# EAGLE design gps_tracker_mark2 (EAGLE 7.4.0)

## Sheet 1 of 3: Flight
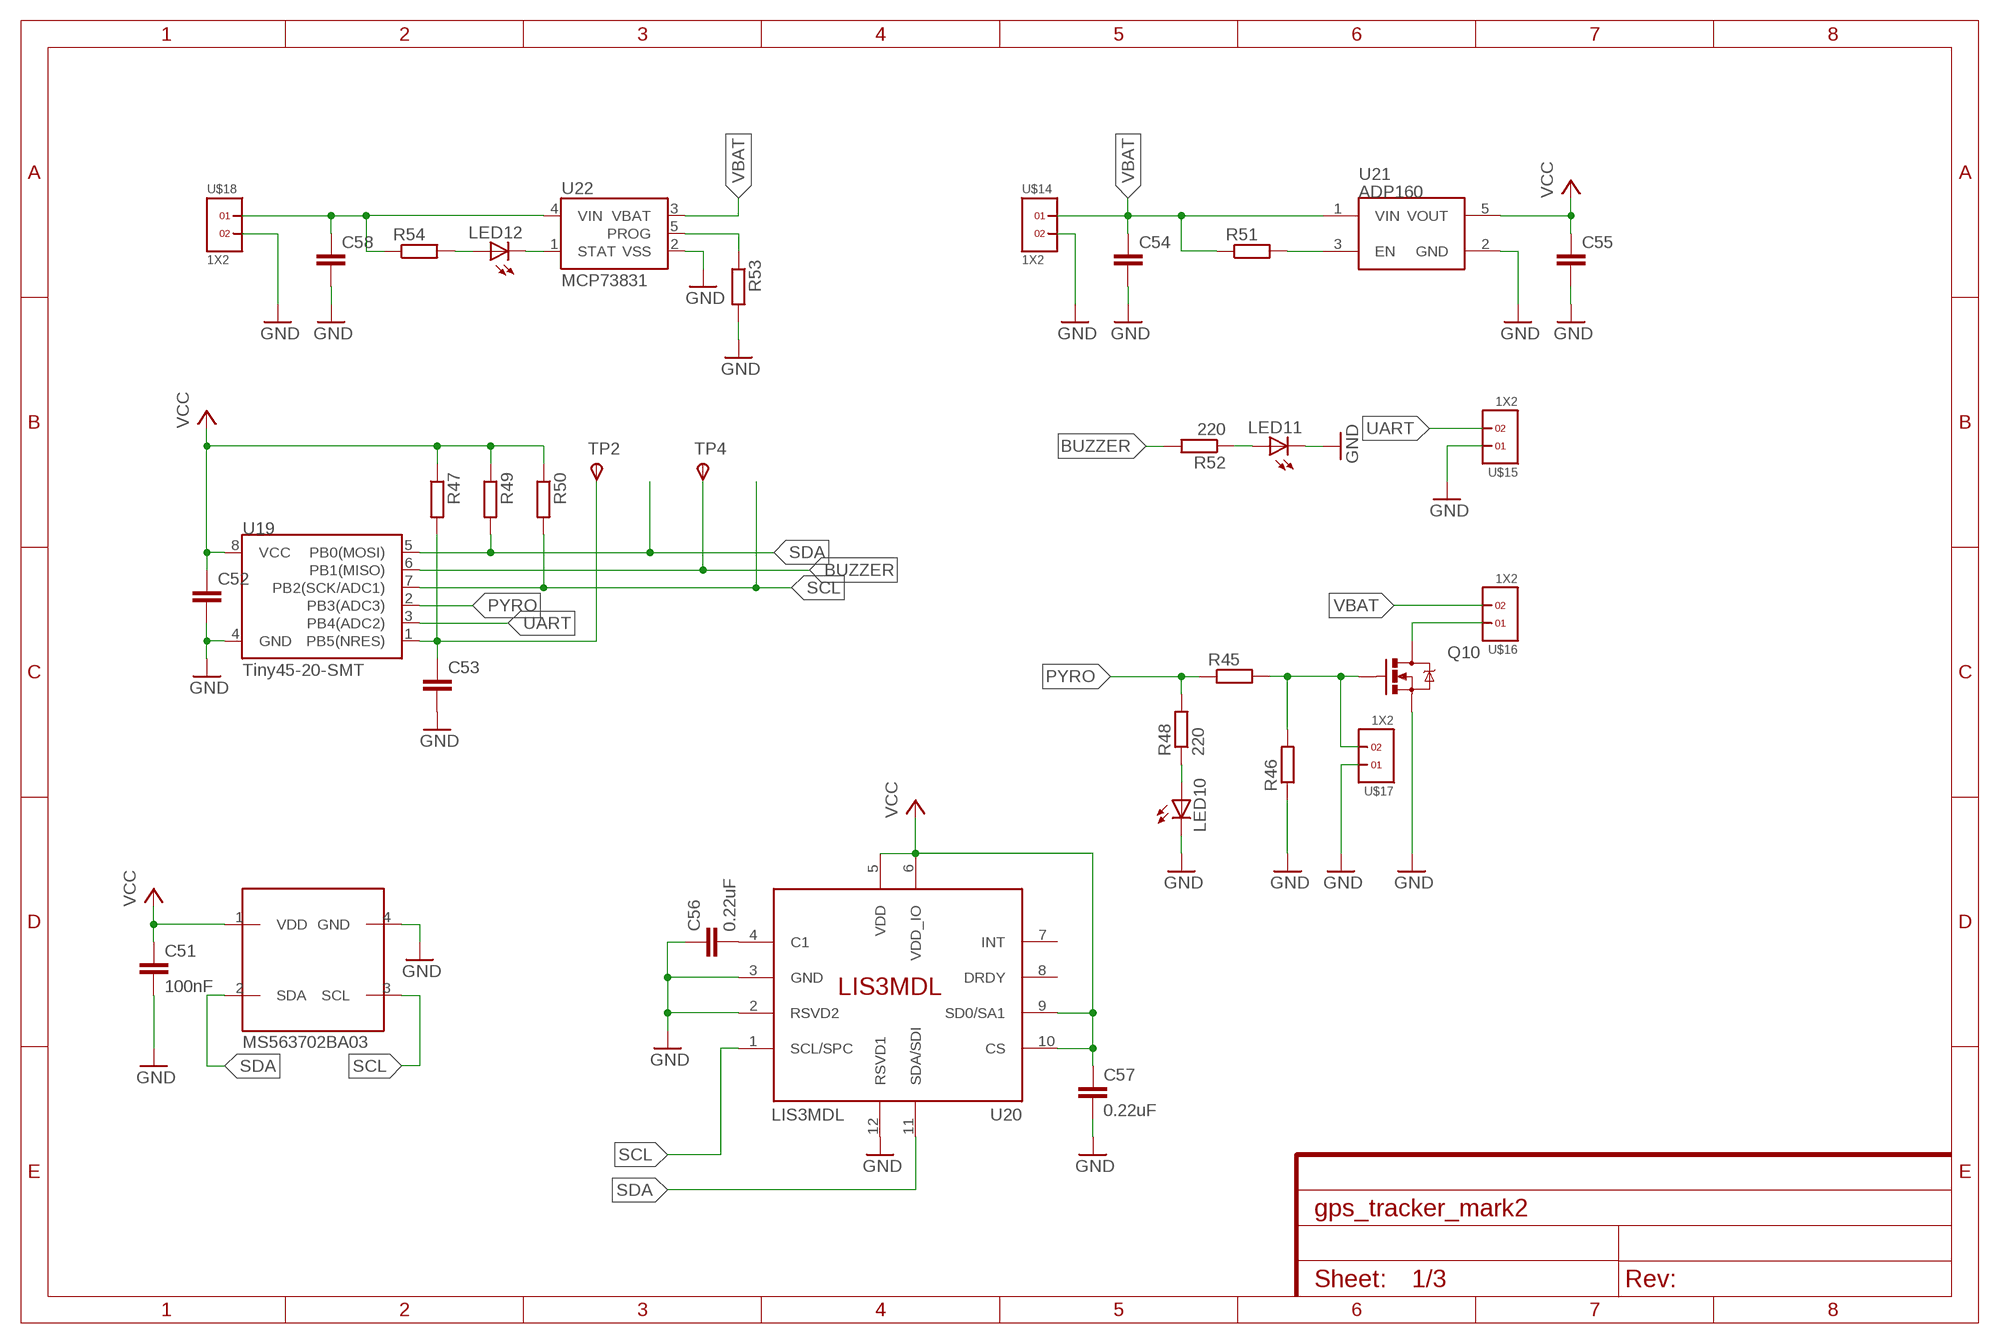
[diagram p0: schematic, sheet 1]

### Parts
C51  100nF  C-EUC0603  [C0603]
C52  C-EUC1206  [C1206]
C53  C-EUC0603  [C0603]
C54  C-EUC0603  [C0603]
C55  C-EUC0603  [C0603]
C56  0.22uF  C-EUC0603K  [C0603K]
C57  0.22uF  C-EUC0603  [C0603]
C58  C-EUC0603  [C0603]
IC2  MS563702BA03  [MS5637]
LED10  LEDCHIPLED_0805  [CHIPLED_0805]
LED11  LEDCHIPLED_0805  [CHIPLED_0805]
LED12  LEDCHIPLED_0603  [CHIPLED_0603]
Q10  MOSFET-NCHANNELBSS123LT1G  [SOT23-3]
R45  R-EU_R0603  [R0603]
R46  R-EU_R0603  [R0603]
R47  R-EU_R0603  [R0603]
R48  220  R-EU_R0603  [R0603]
R49  R-EU_R0603  [R0603]
R50  R-EU_R0603  [R0603]
R51  R-EU_R0603  [R0603]
R52  220  R-EU_R0603  [R0603]
R53  R-EU_R0603  [R0603]
R54  R-EU_R0603  [R0603]
TP2  TPSB1,27  [B1,27]
TP4  TPSB1,27  [B1,27]
U19  Tiny45-20-SMT  ATTINY45TINY45-20-SMT  [SO08-EIAJ]
U20  LIS3MDL  [VFLGA-12]
U21  ADP160  [SOT23-5]
U22  MCP73831  [SOT23-5]
U$14  1X2  [1X2]
U$15  1X2  [1X2]
U$16  1X2  [1X2]
U$17  1X2  [1X2]
U$18  1X2  [1X2]

### Nets
BUZZER: R52.2 TP4.TP(PP) U19.6(PB1(MISO))
GND: C51.2 C52.2 C53.2 C54.2 C55.2 C56.1 C57.2 C58.2 IC2.4(GND) LED10.C LED11.C Q10.2(S) R46.1 R53.2 U19.4(GND) U20.2(RSVD2) U20.3(GND) U20.12(RSVD1) U21.2(GND) U22.2(VSS) U$14.2 U$15.1 U$17.1 U$18.2
N$132: C53.1 R47.2 TP2.TP(PP) U19.1(PB5(NRES))
N$133: Q10.1(G) R45.2 R46.2 U$17.2
N$134: LED10.A R48.1
N$135: C56.2 U20.4(C1)
N$136: R51.2 U21.3(EN)
N$137: LED11.A R52.1
N$138: Q10.3(D) U$16.1
N$139: R53.1 U22.5(PROG)
N$140: LED12.C U22.1(STAT)
N$141: LED12.A R54.2
N$142: C58.1 R54.1 U22.4(VIN) U$18.1
PYRO: R45.1 R48.2 U19.2(PB3(ADC3))
SCL: IC2.3(SCL) R50.2 U19.7(PB2(SCK/ADC1)) U20.1(SCL/SPC)
SDA: IC2.2(SDA) R49.2 U19.5(PB0(MOSI)) U20.11(SDA/SDI)
UART: U19.3(PB4(ADC2)) U$15.2
VBAT: C54.1 R51.1 U21.1(VIN) U22.3(VBAT) U$14.1 U$16.2
VCC: C51.1 C52.1 C55.1 C57.1 IC2.1(VDD) R47.1 R49.1 R50.1 U19.8(VCC) U20.5(VDD) U20.6(VDD_IO) U20.9(SD0/SA1) U20.10(CS) U21.5(VOUT)
Unconnected: U20.7(INT) U20.8(DRDY)

## Sheet 2 of 3: A2235-H
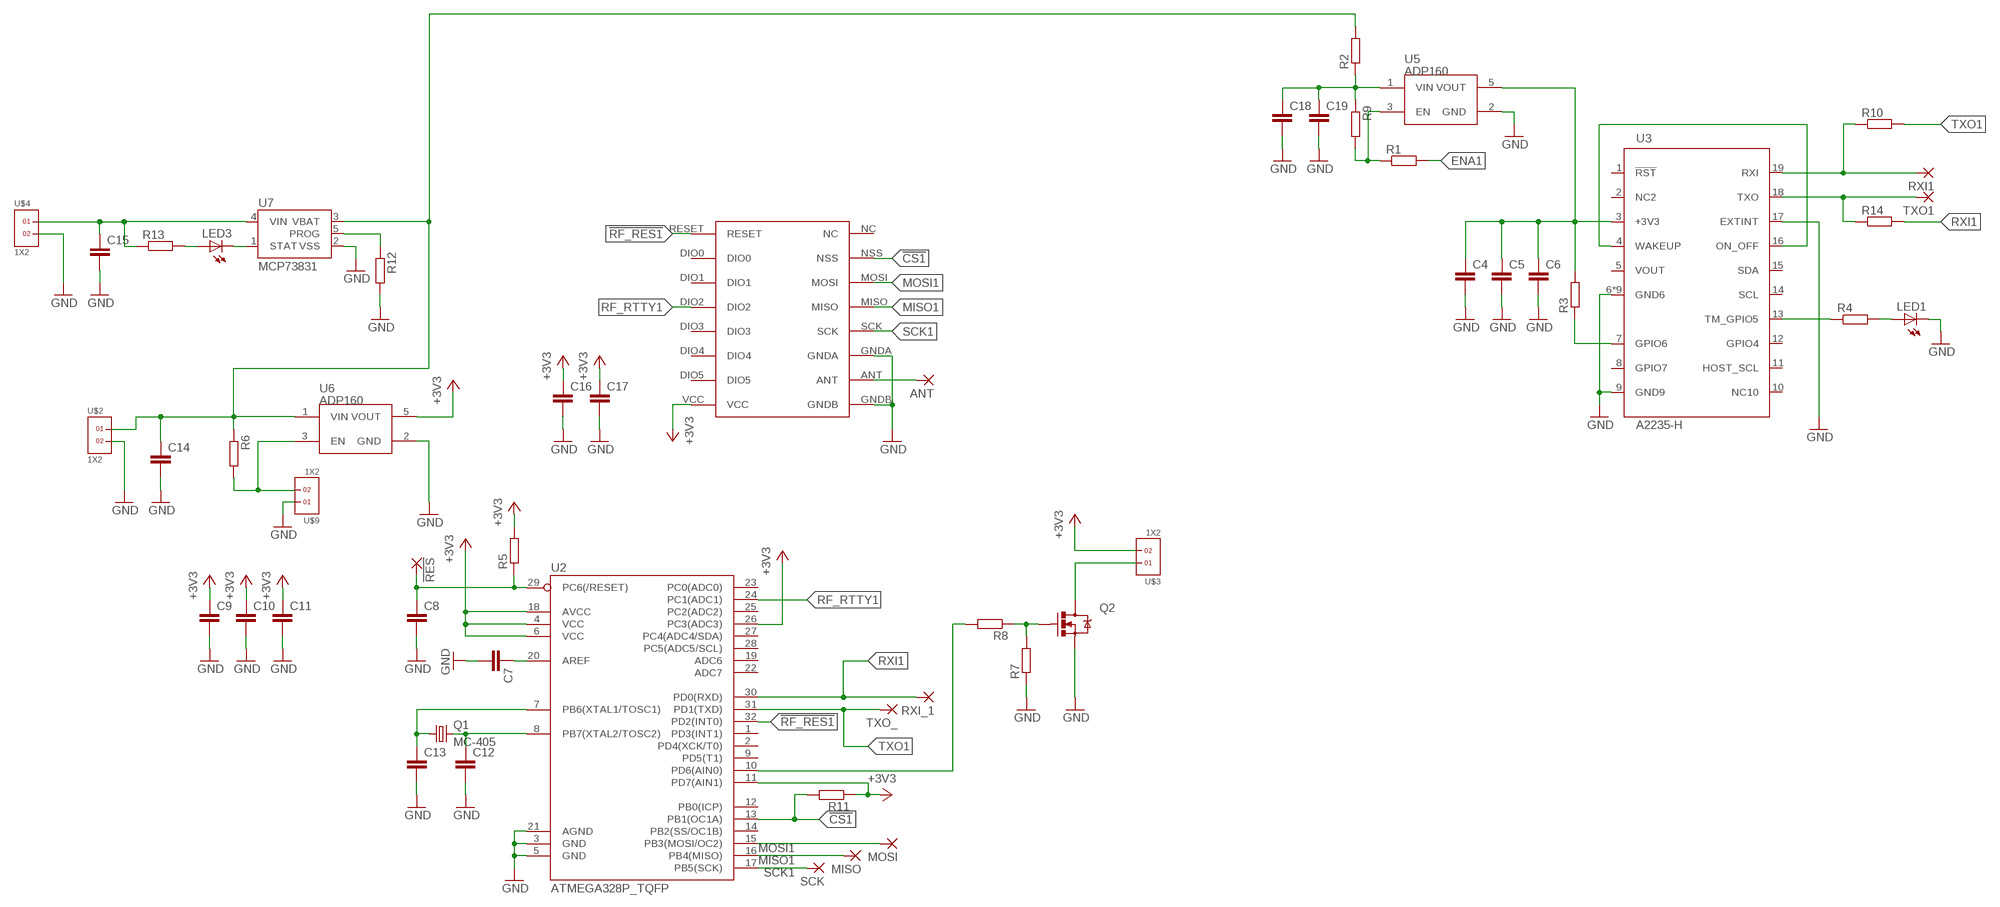
[diagram p1: schematic, sheet 2]

### Parts
!RES  SMD2  [SMD1,27-2,54]
ANT  SMD2  [SMD1,27-2,54]
C4  C-EUC0603  [C0603]
C5  C-EUC0603  [C0603]
C6  C-EUC0603  [C0603]
C7  C-EUC0603  [C0603]
C8  C-EUC0603  [C0603]
C9  C-EUC0603  [C0603]
C10  C-EUC0603  [C0603]
C11  C-EUC0603  [C0603]
C12  C-EUC0603  [C0603]
C13  C-EUC0603  [C0603]
C14  C-EUC0603  [C0603]
C15  C-EUC0603  [C0603]
C16  C-EUC0603  [C0603]
C17  C-EUC0603  [C0603]
C18  C-EUC0603  [C0603]
C19  C-EUC0603  [C0603]
LED1  LEDCHIPLED_0603  [CHIPLED_0603]
LED3  LEDCHIPLED_0603  [CHIPLED_0603]
MISO  SMD2  [SMD1,27-2,54]
MOSI  SMD2  [SMD1,27-2,54]
Q1  MC-405  [MC-405]
Q2  MOSFET-NCHANNELAO3404A  [SOT23-3]
R1  R-EU_R0603  [R0603]
R2  R-EU_R0603  [R0603]
R3  R-EU_R0603  [R0603]
R4  R-EU_R0603  [R0603]
R5  R-EU_R0603  [R0603]
R6  R-EU_R0603  [R0603]
R7  R-EU_R0603  [R0603]
R8  R-EU_R0603  [R0603]
R9  R-EU_R0603  [R0603]
R10  R-EU_R0603  [R0603]
R11  R-EU_R0603  [R0603]
R12  R-EU_R0603  [R0603]
R13  R-EU_R0603  [R0603]
R14  R-EU_R0603  [R0603]
RXI1  SMD2  [SMD1,27-2,54]
RXI_1  SMD2  [SMD1,27-2,54]
SCK  SMD2  [SMD1,27-2,54]
TXO1  SMD2  [SMD1,27-2,54]
TXO_  SMD2  [SMD1,27-2,54]
U2  ATMEGA328P_TQFP  [TQFP32-08]
U3  A2235-H  [A2235-H]
U5  ADP160  [SOT23-5]
U6  ADP160  [SOT23-5]
U7  MCP73831  [SOT23-5]
U$1  RFM69HW  [RFM]
U$2  1X2  [1X2]
U$3  1X2  [1X2]
U$4  1X2  [1X2]
U$9  1X2  [1X2]

### Nets
!CS1: R11.2 U2.13(PB1(OC1A)) U$1.NSS
!RF_RES1: U2.32(PD2(INT0)) U$1.RESET
+3V3_1: C9.1 C10.1 C11.1 C16.1 C17.1 R5.2 R11.1 U2.4(VCC) U2.6(VCC) U2.11(PD7(AIN1)) U2.18(AVCC) U2.26(PC3(ADC3)) U6.5(VOUT) U$1.VCC U$3.2 ; supply symbol labelled +3V3
+BAT1: C14.1 R2.2 R6.1 U6.1(VIN) U7.3(VBAT) U$2.1
ENA1: R1.2 R6.2 U6.3(EN) U$9.2
GND1: C4.2 C5.2 C6.2 C7.2 C8.2 C9.2 C10.2 C11.2 C12.2 C13.2 C14.2 C15.2 C16.2 C17.2 C18.2 C19.2 LED1.C Q2.2(S) R7.1 R12.2 U2.3(GND) U2.5(GND) U2.21(AGND) U3.6(GND6) U3.9(GND9) U3.17(EXTINT) U3.101(GND6) U3.102(GND6) U3.103(GND6) U3.104(GND6) U3.105(GND6) U3.106(GND6) U3.107(GND6) U3.108(GND6) U5.2(GND) U6.2(GND) U7.2(VSS) U$1.GNDA U$1.GNDB U$2.2 U$4.2 U$9.1 ; supply symbol labelled GND
MISO1: MISO.1(P) U2.16(PB4(MISO)) U$1.MISO
MOSI1: MOSI.1(P) U2.15(PB3(MOSI/OC2)) U$1.MOSI
N$2: R1.1 R9.2 U5.3(EN)
N$3: C18.1 C19.1 R2.1 R9.1 U5.1(VIN)
N$6: R3.1 U3.7(GPIO6)
N$7: LED1.A R4.2
N$8: R4.1 U3.13(TM_GPIO5)
N$9: U3.4(WAKEUP) U3.16(ON_OFF)
N$11: R12.1 U7.5(PROG)
N$12: C7.1 U2.20(AREF)
N$13: !RES.1(P) C8.1 R5.1 U2.29(PC6(/RESET))
N$14: ANT.1(P) U$1.ANT
N$15: C12.1 Q1.2 U2.8(PB7(XTAL2/TOSC2))
N$16: C13.1 Q1.1 U2.7(PB6(XTAL1/TOSC1))
N$18: LED3.C U7.1(STAT)
N$19: Q2.1(G) R7.2 R8.1
N$20: R8.2 U2.10(PD6(AIN0))
N$21: Q2.3(D) U$3.1
N$22: LED3.A R13.2
N$24: C15.1 R13.1 U7.4(VIN) U$4.1
N$27: C4.1 C5.1 C6.1 R3.2 U3.3(+3V3) U5.5(VOUT)
RF_RTTY1: U2.24(PC1(ADC1)) U$1.DIO2
RXI1: R14.2 RXI_1.1(P) U2.30(PD0(RXD))
RXI_G1: R10.1 RXI1.1(P) U3.19(RXI)
SCK1: SCK.1(P) U2.17(PB5(SCK)) U$1.SCK
TXO1: R10.2 TXO_.1(P) U2.31(PD1(TXD))
TXO_G1: R14.1 TXO1.1(P) U3.18(TXO)
Unconnected: U2.1(PD3(INT1)) U2.2(PD4(XCK/T0)) U2.9(PD5(T1)) U2.12(PB0(ICP)) U2.14(PB2(SS/OC1B)) U2.19(ADC6) U2.22(ADC7) U2.23(PC0(ADC0)) U2.25(PC2(ADC2)) U2.27(PC4(ADC4/SDA)) U2.28(PC5(ADC5/SCL)) U3.1(!RST) U3.2(NC2) U3.8(GPIO7) U3.10(NC10) U3.11(HOST_SCL) U3.12(GPIO4) U3.14(SCL) U3.15(SDA) U$1.DIO0 U$1.DIO1 U$1.DIO3 U$1.DIO4 U$1.DIO5 U$1.NC

## Sheet 3 of 3: ORG1411
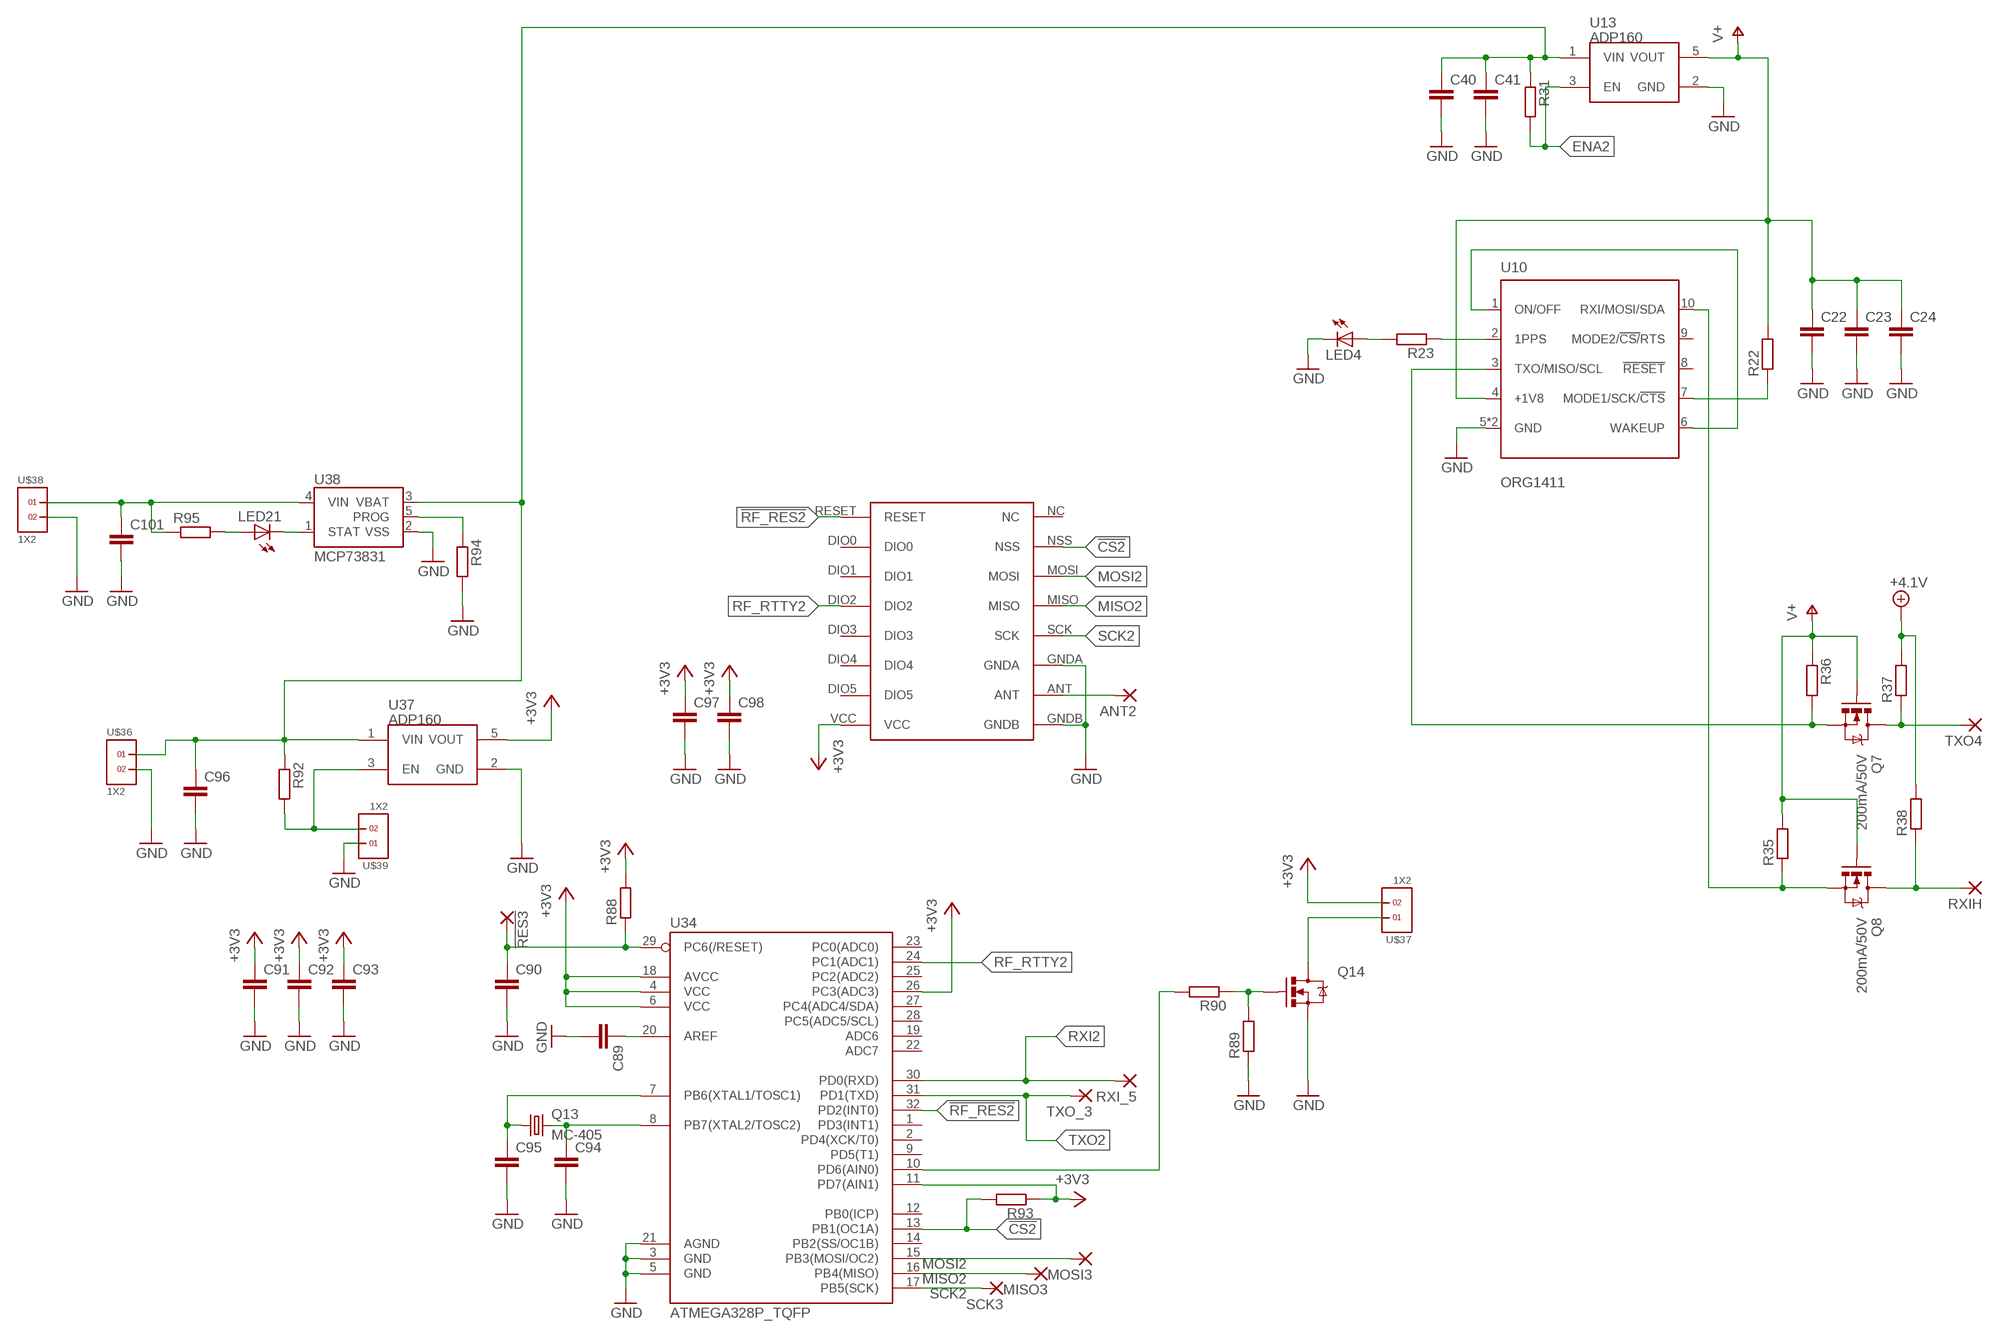
[diagram p2: schematic, sheet 3]

### Parts
!RES3  SMD2  [SMD1,27-2,54]
ANT2  SMD2  [SMD1,27-2,54]
C22  C-EUC0603  [C0603]
C23  C-EUC0603  [C0603]
C24  C-EUC0603  [C0603]
C40  C-EUC0603  [C0603]
C41  C-EUC0603  [C0603]
C89  C-EUC0603  [C0603]
C90  C-EUC0603  [C0603]
C91  C-EUC0603  [C0603]
C92  C-EUC0603  [C0603]
C93  C-EUC0603  [C0603]
C94  C-EUC0603  [C0603]
C95  C-EUC0603  [C0603]
C96  C-EUC0603  [C0603]
C97  C-EUC0603  [C0603]
C98  C-EUC0603  [C0603]
C101  C-EUC0603  [C0603]
LED4  LEDCHIPLED_0603  [CHIPLED_0603]
LED21  LEDCHIPLED_0603  [CHIPLED_0603]
MISO3  SMD2  [SMD1,27-2,54]
MOSI3  SMD2  [SMD1,27-2,54]
Q7  200mA/50V  MOSFET-NCHANNELBSS138  [SOT23-3]
Q8  200mA/50V  MOSFET-NCHANNELBSS138  [SOT23-3]
Q13  MC-405  [MC-405]
Q14  MOSFET-NCHANNELAO3404A  [SOT23-3]
R22  R-EU_R0603  [R0603]
R23  R-EU_R0603  [R0603]
R31  R-EU_R0603  [R0603]
R35  R-EU_R0603  [R0603]
R36  R-EU_R0603  [R0603]
R37  R-EU_R1206  [R1206]
R38  R-EU_R1206  [R1206]
R88  R-EU_R0603  [R0603]
R89  R-EU_R0603  [R0603]
R90  R-EU_R0603  [R0603]
R92  R-EU_R0603  [R0603]
R93  R-EU_R0603  [R0603]
R94  R-EU_R0603  [R0603]
R95  R-EU_R0603  [R0603]
RXI_5  SMD2  [SMD1,27-2,54]
RXIH  SMD2  [SMD1,27-2,54]
SCK3  SMD2  [SMD1,27-2,54]
TXO4  SMD2  [SMD1,27-2,54]
TXO_3  SMD2  [SMD1,27-2,54]
U10  ORG1411  [ORG1411]
U13  ADP160  [SOT23-5]
U34  ATMEGA328P_TQFP  [TQFP32-08]
U37  ADP160  [SOT23-5]
U38  MCP73831  [SOT23-5]
U$35  RFM69HW  [RFM]
U$36  1X2  [1X2]
U$37  1X2  [1X2]
U$38  1X2  [1X2]
U$39  1X2  [1X2]

### Nets
!CS2: R93.2 U34.13(PB1(OC1A)) U$35.NSS
!RF_RES2: U34.32(PD2(INT0)) U$35.RESET
+3V3_2: C91.1 C92.1 C93.1 C97.1 C98.1 R88.2 R93.1 U34.4(VCC) U34.6(VCC) U34.11(PD7(AIN1)) U34.18(AVCC) U34.26(PC3(ADC3)) U37.5(VOUT) U$35.VCC U$37.2 ; supply symbol labelled +3V3
+4.1V: R37.2 R38.2
+BAT2: C40.1 C41.1 C96.1 R31.1 R92.1 U13.1(VIN) U37.1(VIN) U38.3(VBAT) U$36.1
ANT2: ANT2.1(P) U$35.ANT
ENA2: R31.2 R92.2 U13.3(EN) U37.3(EN) U$39.2
GND2: C22.2 C23.2 C24.2 C40.2 C41.2 C89.2 C90.2 C91.2 C92.2 C93.2 C94.2 C95.2 C96.2 C97.2 C98.2 C101.2 LED4.C Q14.2(S) R89.1 R94.2 U10.5(GND) U10.11(GND) U13.2(GND) U34.3(GND) U34.5(GND) U34.21(AGND) U37.2(GND) U38.2(VSS) U$35.GNDA U$35.GNDB U$36.2 U$38.2 U$39.1 ; supply symbol labelled GND
MISO2: MISO3.1(P) U34.16(PB4(MISO)) U$35.MISO
MOSI2: MOSI3.1(P) U34.15(PB3(MOSI/OC2)) U$35.MOSI
N$29: U10.1(ON/OFF) U10.6(WAKEUP)
N$30: R22.1 U10.7(MODE1/SCK/!CTS)
N$31: R23.1 U10.2(1PPS)
N$32: LED4.A R23.2
N$54: Q7.2(S) R36.2 U10.3(TXO/MISO/SCL)
N$55: Q7.3(D) R37.1 TXO4.1(P)
N$56: Q8.3(D) R38.1 RXIH.1(P)
N$57: Q8.2(S) R35.1 U10.10(RXI/MOSI/SDA)
N$162: C89.1 U34.20(AREF)
N$163: !RES3.1(P) C90.1 R88.1 U34.29(PC6(/RESET))
N$165: C94.1 Q13.2 U34.8(PB7(XTAL2/TOSC2))
N$166: C95.1 Q13.1 U34.7(PB6(XTAL1/TOSC1))
N$167: Q14.1(G) R89.2 R90.1
N$168: R90.2 U34.10(PD6(AIN0))
N$169: Q14.3(D) U$37.1
N$171: R94.1 U38.5(PROG)
N$172: LED21.C U38.1(STAT)
N$173: LED21.A R95.2
N$174: C101.1 R95.1 U38.4(VIN) U$38.1
RF_RTTY2: U34.24(PC1(ADC1)) U$35.DIO2
RXI2: RXI_5.1(P) U34.30(PD0(RXD))
SCK2: SCK3.1(P) U34.17(PB5(SCK)) U$35.SCK
TXO2: TXO_3.1(P) U34.31(PD1(TXD))
V+: C22.1 C23.1 C24.1 Q7.1(G) Q8.1(G) R22.2 R35.2 R36.1 U10.4(+1V8) U13.5(VOUT)
Unconnected: U10.8(!RESET) U10.9(MODE2/!CS/!RTS) U34.1(PD3(INT1)) U34.2(PD4(XCK/T0)) U34.9(PD5(T1)) U34.12(PB0(ICP)) U34.14(PB2(SS/OC1B)) U34.19(ADC6) U34.22(ADC7) U34.23(PC0(ADC0)) U34.25(PC2(ADC2)) U34.27(PC4(ADC4/SDA)) U34.28(PC5(ADC5/SCL)) U$35.DIO0 U$35.DIO1 U$35.DIO3 U$35.DIO4 U$35.DIO5 U$35.NC

## Power pins joined to a net without a drawn wire
VOUT: U3.5(VOUT)

## Library data of the parts
!RES !RES3 ANT ANT2 MISO MISO3 MOSI MOSI3 RXI1 RXI_1 RXI_5 RXIH SCK SCK3 TXO1 TXO4 TXO_ TXO_3 = wirepad:SMD2: SMD PAD
C4-C19 C22-C24 C40 C41 C51-C58 C89-C98 C101 = rcl:C-EU: CAPACITOR, European symbol
IC2 = freetronics-original:MS5637
LED1 LED3 LED4 LED10-LED12 LED21 = led:LED: LED OSRAM: - CHIPLED LG R971, LG N971, LY N971, LG Q971, LY Q971, LO R971, LY R971 LH N974, LH R974 LS Q976, LO Q976, LY Q976 LO Q996 - Hyper CHIPLED LW Q18S LB Q993, LB Q99A, LB R99A - SideLED LS A670, LO A670, LY A670, LG A670, LP A670 LB A673, LV A673, LT A673, LW A673 LH A674 LY A675 LS A676, LA A676, LO A676, LY A676, LW A676 LS A679, LY A679, LG A679 - Hyper Micro SIDELED® LS Y876, LA Y876, LO Y876, LY Y876 LT Y87S - SmartLED LW L88C, LW L88S LB L89C, LB L89S, LG L890 LS L89K, LO L89K, LY L89K LS L896, LA L896, LO L896, LY L896 - TOPLED LS T670, LO T670, LY T670, LG T670, LP T670 LSG T670, LSP T670, LSY T670, LOP T670, LYG T670 LG T671, LOG T671, LSG T671 LB T673, LV T673, LT T673, LW T673 LH T674 LS T676, LA T676, LO T676, LY T676, LB T676, LH T676, LSB T676, LW T676 LB T67C, LV T67C, LT T67C, LS T67K, LO T67K, LY T67K, LW E67C LS E67B, LA E67B, LO E67B, LY E67B, LB E67C, LV E67C, LT E67C LW T67C LS T679, LY T679, LG T679 LS T770, LO T770, LY T770, LG T770, LP T770 LB T773, LV T773, LT T773, LW T773 LH T774 LS E675, LA E675, LY E675, LS T675 LS T776, LA T776, LO T776, LY T776, LB T776 LHGB T686 LT T68C, LB T68C - Hyper Mini TOPLED® LB M676 - Mini TOPLED Santana® LG M470 LS M47K, LO M47K, LY M47K Source: http://www.osram.convergy.de LUXEON: - LUMILED® LXK2-PW12-R00, LXK2-PW12-S00, LXK2-PW14-U00, LXK2-PW14-V00 LXK2-PM12-R00, LXK2-PM12-S00, LXK2-PM14-U00 LXK2-PE12-Q00, LXK2-PE12-R00, LXK2-PE12-S00, LXK2-PE14-T00, LXK2-PE14-U00 LXK2-PB12-K00, LXK2-PB12-L00, LXK2-PB12-M00, LXK2-PB14-N00, LXK2-PB14-P00, LXK2-PB14-Q00 LXK2-PR12-L00, LXK2-PR12-M00, LXK2-PR14-Q00, LXK2-PR14-R00 LXK2-PD12-Q00, LXK2-PD12-R00, LXK2-PD12-S00 LXK2-PH12-R00, LXK2-PH12-S00 LXK2-PL12-P00, LXK2-PL12-Q00, LXK2-PL12-R00 Source: www.luxeon.com KINGBRIGHT: KA-3528ASYC Source: www.kingbright.com
Q1 Q13 = gps_tracker:MC-405: kHz RANGE CRYSTAL UNIT SMD Source: MC-306_405_406_E07X.PDF Homepage <http://www.epsontoyocom.co.jp>; FARNELL: 2508596; OC_FARNELL: unknown; OC_NEWARK: unknown
Q2 Q14 = SparkFun-DiscreteSemi:MOSFET-NCHANNEL: Common NMOSFET Parts MFG P/N Store ID Prod ID FDD8780 TRANS-09984 SI7820DN TRANS-11055 FDS6630A IC-08089 2N7002PW TRANS-11151 FQP30N06L COM-10213 TRANS-10060 BSS123LT1G TRANS-08345 BSS138 TRANS-00830 BS170 2N7000; PROD_ID: TRAN-12988
Q7 Q8 = SparkFun-DiscreteSemi:MOSFET-NCHANNEL: Common NMOSFET Parts MFG P/N Store ID Prod ID FDD8780 TRANS-09984 SI7820DN TRANS-11055 FDS6630A IC-08089 2N7002PW TRANS-11151 FQP30N06L COM-10213 TRANS-10060 BSS123LT1G TRANS-08345 BSS138 TRANS-00830 BS170 2N7000; PROD_ID: TRANS-00830
Q10 = SparkFun-DiscreteSemi:MOSFET-NCHANNEL: Common NMOSFET Parts MFG P/N Store ID Prod ID FDD8780 TRANS-09984 SI7820DN TRANS-11055 FDS6630A IC-08089 2N7002PW TRANS-11151 FQP30N06L COM-10213 TRANS-10060 BSS123LT1G TRANS-08345 BSS138 TRANS-00830 BS170 2N7000; PROD_ID: TRANS-08345
R1-R14 R22 R23 R31 R35-R38 R45-R47 R49-R51 R53 R54 R88-R90 R92-R95 = rcl:R-EU_: RESISTOR, European symbol
R48 R52 = resistor:R-EU_: RESISTOR, European symbol
TP2 TP4 = testpad:TPS: TEST PIN
U2 U34 = SparkFun-DigitalIC:ATMEGA328P_TQFP; PROD_ID: IC-09069
U3 = gps_tracker:A2235-H
U5 U6 U21 U37 = SparkFun-PowerIC:ADP160: Nanopower LDO Iq less than 1uA for low Iload; FARNELL: 2510377; PROD_ID: VREG-11306
U7 U22 U38 = SparkFun-PowerIC:MCP73831: Miniature single cell, fully integrated Li-Ion, Li-polymer charge management controller http://ww1.microchip.com/downloads/en/DeviceDoc/20001984g.pdf IC-09995; FARNELL: 1834892; PROD_ID: IC-09995
U10 = gps_tracker:ORG1411
U13 = SparkFun-PowerIC:ADP160: Nanopower LDO Iq less than 1uA for low Iload; FARNELL: 2510505; PROD_ID: VREG-11306
U19 = SparkFun-DigitalIC:ATTINY45: Atmel 8-pin 2/4/8kB flash uC; PROD_ID: IC-08922
U20 = kg-ic:LIS3MDL: Digital output magnetic sensor: ultra-low-power high-performance 3-axis magnetometer The LIS3MDL is an ultra-low-power high-performance three-axis Magnetic Sensor. It has user-selectable full scales of ±4/ ±8/ ±12/ ±16 gauss. The self-test capability allows the user to check the functioning of the sensor in the final application. The device may be configured to generate interrupt signals for magnetic field detection. It includes an I²C serial bus interface that supports standard and fast mode (100 and 400kHz) and SPI serial standard interface. Independent IO Supply (1.8V) ±4/±8/±12/±16 Gauss Selectable Magnetic Full Scale Continuous and Single-conversion Modes 16-bit Data Output Interrupt Generator Self-test I²C/SPI Digital Output Interface Power-down Mode/Low-power Mode
U$1 U$35 = hoperf:RFM69HW
U$2-U$4 U$9 U$14-U$18 U$36-U$39 = headers(2mm)(samtec):1X2

## Board
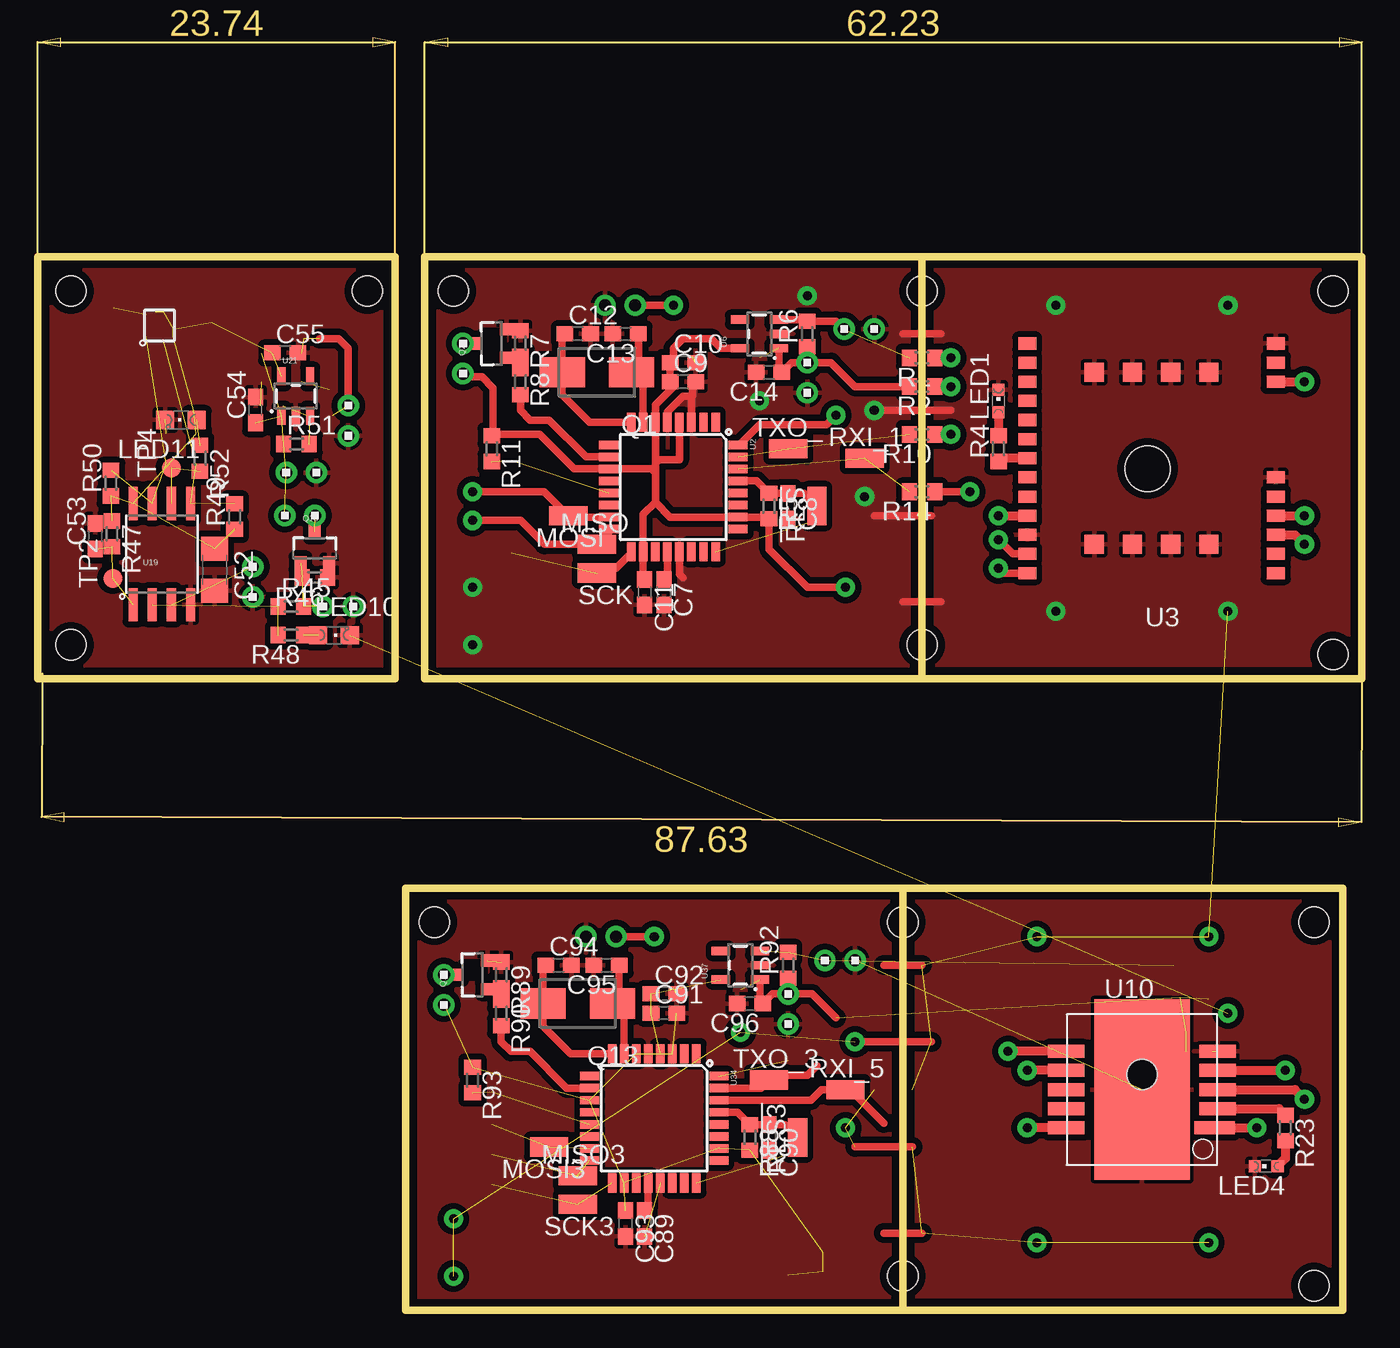
[diagram p3: board, top side]
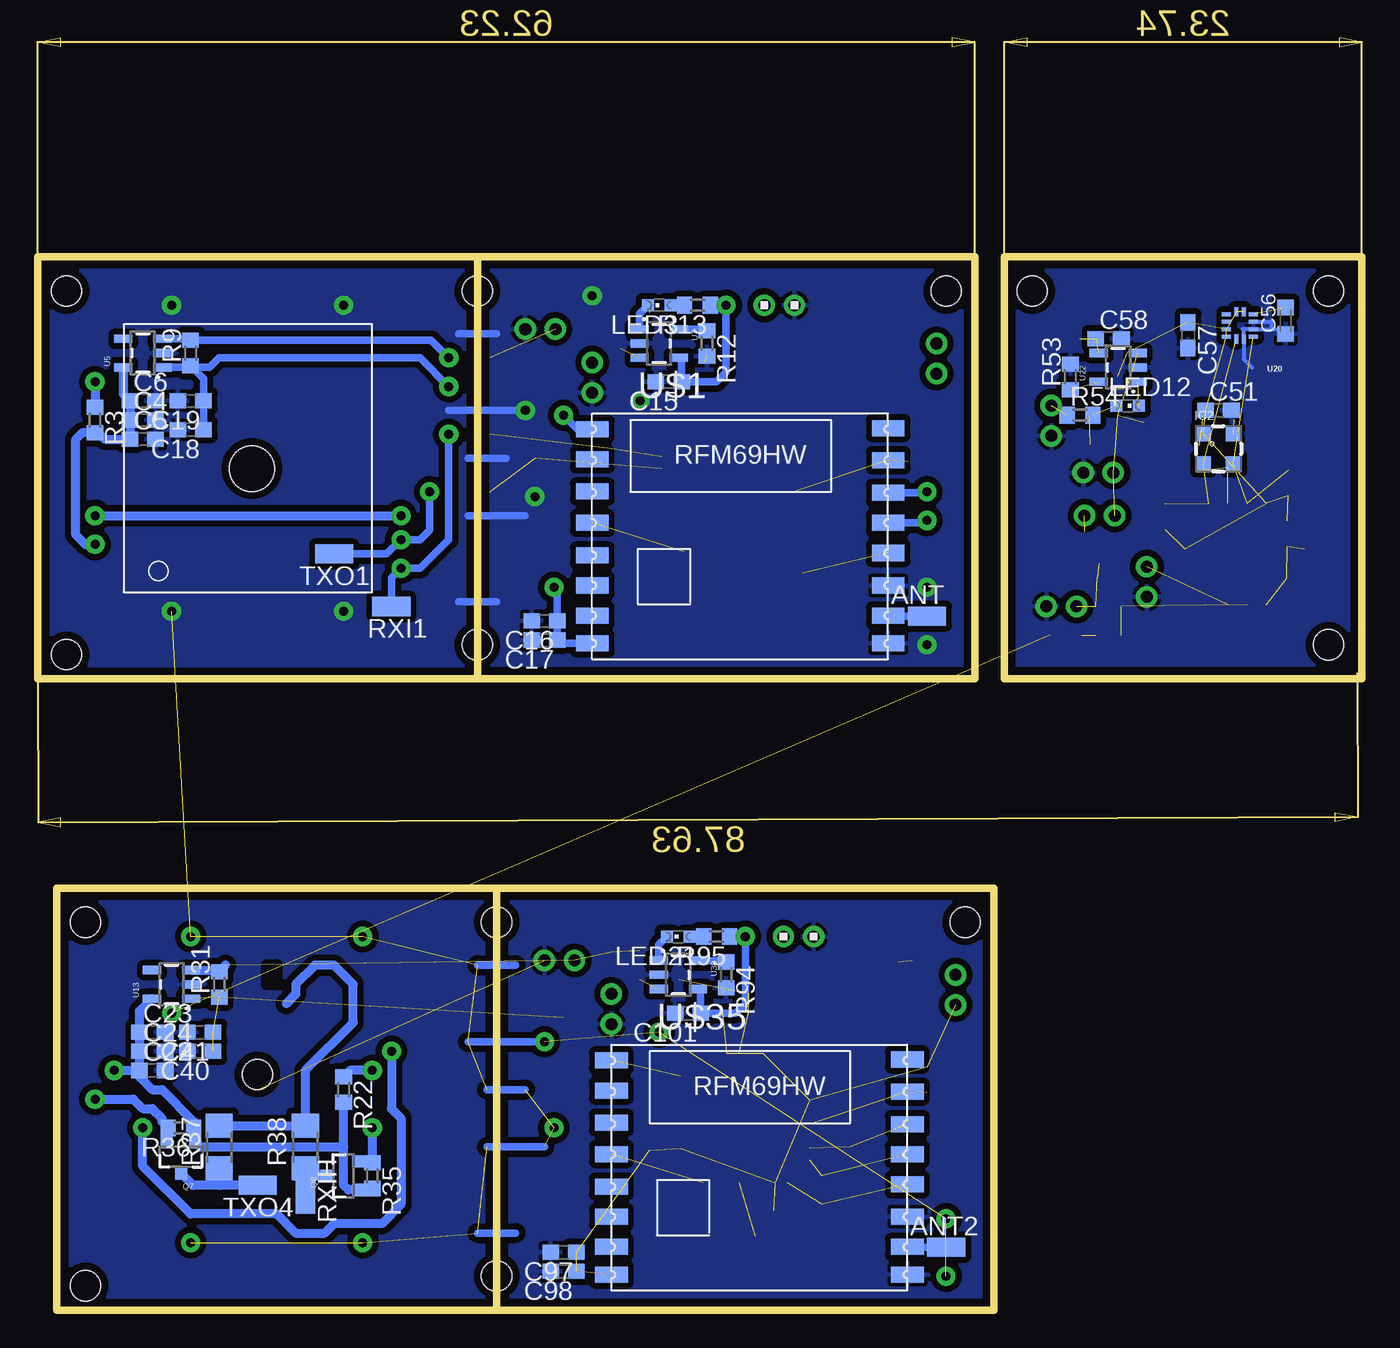
[diagram p4: board, bottom side, seen from below]

Size 87.94 x 69.91 mm. Coordinates in mm from the lower left corner, seen from the top.
Outline: 58.73,69.91 25.71,69.91 25.71,41.91 58.73,41.91
Outline: 58.73,69.91 58.73,41.91
Outline: 58.73,69.91 87.94,69.91 87.94,41.91 58.73,41.91
Outline: 57.46,28 24.44,28 24.44,0 57.46,0
Outline: 57.46,28 57.46,0
Outline: 57.46,28 86.67,28 86.67,0 57.46,0
Outline: 0,41.91 23.74,41.91 23.74,69.91 0,69.91 0,41.91
Copper layers (1*16): Top 0.035mm / dielectric 12.5mil / Bottom 0.035mm
Design rules "default *": minimum track width 10mil, minimum drill 24mil, track to track 8mil, track to pad 8mil, pad to pad 8mil, via to via 8mil, smd to smd 8mil, copper to edge 20mil, drill to drill 8mil, minimum pad ring 10mil, minimum via ring 8mil, stop-mask expansion 4mil, vias tented up to drill 0mil, thermal gap 10mil
Holes 2 mm at 2.21,44.16 2.21,67.66 21.9,67.66 27.61,67.66 86.03,67.66 58.73,44.16 58.73,67.66 86.03,43.53 26.34,25.75 84.76,25.75 57.46,2.25 57.46,25.75 84.76,1.62
tRestrict: area 29.5,64.2 to 30.8,64.8; area 35.9,62.9 to 38.4,63.5; area 38.4,66.1 to 39,66.7; area 38.4,48.3 to 39.7,48.9; area 28.2,22.3 to 29.5,22.9; area 34.6,21 to 37.1,21.6; area 37.1,24.2 to 37.8,24.8; area 37.1,6.4 to 38.4,7
bRestrict: area 8.3,55.9 to 10.8,58.5; area 72.1,21.6 to 72.7,22.9

### Footprints (pad centres in the part's own frame; a part is rotated, then mirrored left to right if it is on the bottom)
SMD1,27-2,54 = smd 1.27 x 2.54: 1 0,0
C0603 = smd 1.1 x 1: 1 -0.85,0; 2 0.85,0
C1206 = smd 1.6 x 1.8: 1 -1.4,0; 2 1.4,0
C0603K = smd 1.05 x 1.08: 1 -0.875,0; 2 0.875,0
MS5637 = smd 1 x 1: 1 -1,1; 2 -1,-1; 3 1,-1; 4 1,1
CHIPLED_0603 = smd 0.8 x 0.8: A 0,-0.75; C 0,0.75
CHIPLED_0805 = smd 1.2 x 1.2: A 0,-1.05; C 0,1.05
MC-405 = smd 3 x 2: 1 -2.3,0; 2 2.3,0
SOT23-3 = smd 0.8 x 0.9: 1 -0.95,-1; 2 0.95,-1; 3 0,1.1
R0603 = smd 1 x 1.1: 1 -0.85,0; 2 0.85,0
R1206 = smd 1.6 x 1.803: 1 -1.422,0; 2 1.422,0
B1,27 = smd 1.27 x 1.27: TP 0,0
TQFP32-08 = smd 1.27 x 0.559: 1 -4.293,2.8; 2 -4.293,2; 3 -4.293,1.2; 4 -4.293,0.4; 5 -4.293,-0.4; 6 -4.293,-1.2; 7 -4.293,-2; 8 -4.293,-2.8; 17 4.293,-2.8; 18 4.293,-2; 19 4.293,-1.2; 20 4.293,-0.4; 21 4.293,0.4; 22 4.293,1.2; 23 4.293,2; 24 4.293,2.8 | smd 0.559 x 1.27: 9 -2.8,-4.293; 10 -2,-4.293; 11 -1.2,-4.293; 12 -0.4,-4.293; 13 0.4,-4.293; 14 1.2,-4.293; 15 2,-4.293; 16 2.8,-4.293; 25 2.8,4.293; 26 2,4.293; 27 1.2,4.293; 28 0.4,4.293; 29 -0.4,4.293; 30 -1.2,4.293; 31 -2,4.293; 32 -2.8,4.293
A2235-H = smd 1.2 x 0.8: 1 -8.255,7.62; 2 -8.255,6.35; 3 -8.255,5.08; 4 -8.255,3.81; 5 -8.255,2.54; 6 -8.255,1.27; 7 -8.255,-5.08; 8 -8.255,-6.35; 9 -8.255,-7.62; 10 8.255,-3.81; 11 8.255,-2.54; 12 8.255,-1.27; 13 8.255,0; 14 8.255,1.27; 15 8.255,2.54; 16 8.255,3.81; 17 8.255,5.08; 18 8.255,6.35; 19 8.255,7.62; 201 8.255,-5.08; 202 8.255,-6.35; 203 8.255,-7.62 | smd 1.27 x 1.27: 101 1.27,-5.715; 102 -3.81,-5.715; 103 -3.81,5.715; 104 -1.27,-5.715; 105 -1.27,5.715; 106 3.81,-5.715; 107 3.81,5.715; 108 1.27,5.715 | hole 3: 0.255,0.69
SOT23-5 = smd 0.55 x 1.2: 1 -0.95,-1.3; 2 0,-1.3; 3 0.95,-1.3; 4 0.95,1.3; 5 -0.95,1.3
ORG1411 = smd 2.676 x 0.864: 1 4.818,-2.54 | smd 2.422 x 0.864: 2 5.025,-1.27; 3 5.025,0; 4 5.025,1.27; 5 5.025,2.54; 6 -5.025,2.54; 7 -5.025,1.27; 8 -5.025,0; 9 -5.025,-1.27; 10 -5.025,-2.54 | smd 6.35 x 12: 11 0,0 | hole 2: 0,1
SO08-EIAJ = smd 0.61 x 2.21: 1 -1.905,-3.378; 2 -0.635,-3.378; 3 0.635,-3.378; 4 1.905,-3.378; 5 1.905,3.353; 6 0.635,3.353; 7 -0.635,3.353; 8 -1.905,3.353
VFLGA-12 = smd 0.6 x 0.25: 1 -0.9,0.75; 2 -0.9,0.25; 3 -0.9,-0.25; 4 -0.9,-0.75; 7 0.9,-0.75; 8 0.9,-0.25; 9 0.9,0.25; 10 0.9,0.75 | smd 0.25 x 0.6: 5 -0.25,-0.9; 6 0.25,-0.9; 11 0.25,0.9; 12 -0.25,0.9
RFM = smd 2.184 x 1.067: ANT 9.491,-4.731; DIO0 -10.16,5.65; DIO1 -10.16,3.522; DIO2 -10.16,1.427; DIO3 -10.16,-0.731; DIO4 -10.16,-2.731; DIO5 -10.16,-4.731; GNDA 9.491,-2.731; GNDB 9.491,-6.572; MISO 9.491,1.427; MOSI 9.491,3.428; NC 9.491,7.714; NSS 9.491,5.586; RESET -10.16,7.65; SCK 9.491,-0.573; VCC -10.16,-6.572
1X2 = drill 0.8 pad 1.422: 1 0,0; 2 2,0

### Placement (x,y rotation side)
!RES  51.74,53.37 0 top
!RES3  50.47,11.46 0 top
ANT  28.88,46.07 270 bottom
ANT2  27.61,4.16 270 bottom
C4  80.95,59.09 0 bottom
C5  80.95,57.81 0 bottom
C6  80.95,60.35 0 bottom
C7  41.58,47.66 270 top
C8  49.84,53.37 270 top
C9  42.85,61.62 0 top
C10  42.85,62.89 0 top
C11  40.31,47.66 270 top
C12  35.87,64.8 0 top
C13  39.04,64.8 180 top
C14  48.57,62.26 180 top
C15  46.03,61.62 180 bottom
C16  54.28,45.75 180 bottom
C17  54.28,44.48 180 bottom
C18  77.78,58.45 180 bottom
C19  77.78,60.35 180 bottom
C22  80.32,15.91 0 bottom
C23  80.32,18.45 0 bottom
C24  80.32,17.18 0 bottom
C40  77.14,17.18 180 bottom
C41  77.14,18.45 180 bottom
C51  9.52,59.72 0 bottom
C52  11.76,49.15 270 top
C53  3.84,51.37 90 top
C54  14.47,59.75 90 top
C55  16.43,63.54 0 top
C56  5.06,65.67 90 bottom
C57  11.55,64.71 270 bottom
C58  16.82,64.48 0 bottom
C89  40.31,5.75 270 top
C90  48.57,11.46 270 top
C91  41.58,19.71 0 top
C92  41.58,20.98 0 top
C93  39.04,5.75 270 top
C94  34.6,22.89 0 top
C95  37.77,22.89 180 top
C96  47.3,20.35 180 top
C97  53.01,3.84 180 bottom
C98  53.01,2.57 180 bottom
C101  44.76,19.71 180 bottom
IC2  9.52,57.18 0 bottom
LED1  63.81,60.35 0 top
LED3  46.66,66.7 90 bottom
LED4  81.59,9.55 90 top
LED10  19.68,44.8 270 top
LED11  9.52,59.09 90 top
LED12  15.55,60.04 270 bottom
LED21  45.39,24.79 90 bottom
MISO  37.14,50.83 270 top
MISO3  35.87,8.92 270 top
MOSI  35.23,52.73 90 top
MOSI3  33.96,10.82 90 top
Q1  37.14,62.26 180 top
Q2  30.15,64.17 90 top
Q7  78.41,10.19 180 bottom
Q8  67.62,8.92 90 bottom
Q10  18.4,50.58 0 top
Q13  35.87,20.35 180 top
Q14  28.88,22.25 90 top
R1  58.73,63.21 180 top
R2  58.73,61.31 180 top
R3  84.13,59.09 270 bottom
R4  63.81,57.18 90 top
R5  48.57,53.37 270 top
R6  51.11,64.8 90 top
R7  32.06,64.17 270 top
R8  32.06,61.62 270 top
R9  77.78,63.53 90 bottom
R10  58.73,58.13 180 top
R11  30.15,57.18 270 top
R12  43.49,64.17 270 bottom
R13  44.12,66.7 180 bottom
R14  58.73,54.32 180 top
R22  67.62,14.64 270 bottom
R23  82.86,12.09 270 top
R31  75.87,21.62 90 bottom
R35  65.71,8.92 270 bottom
R36  78.41,12.09 180 bottom
R37  75.87,10.82 90 bottom
R38  70.16,10.82 90 bottom
R45  16.83,46.71 0 top
R46  18.4,48.63 180 top
R47  4.94,51.53 270 top
R48  16.82,44.81 180 top
R49  13.09,52.67 90 top
R50  4.87,54.89 90 top
R51  17.19,57.49 0 top
R52  10.79,56.55 270 top
R53  19.36,61.94 90 bottom
R54  18.72,59.4 0 bottom
R88  47.3,11.46 270 top
R89  30.79,22.25 270 top
R90  30.79,19.71 270 top
R92  49.84,22.89 90 top
R93  28.88,15.27 270 top
R94  42.22,22.25 270 bottom
R95  42.85,24.79 180 bottom
RXI1  64.44,46.7 90 bottom
RXI_1  54.92,56.54 270 top
RXI_5  53.65,14.63 270 top
RXIH  70.16,7.65 180 bottom
SCK  37.14,48.92 90 top
SCK3  35.87,7.01 90 top
TP2  5,48.57 90 top
TP4  8.89,55.91 90 top
TXO1  68.25,50.2 90 bottom
TXO4  73.33,8.29 90 bottom
TXO_  49.84,57.18 270 top
TXO_3  48.57,15.27 270 top
U2  42.22,54.64 270 top
U3  73.97,56.55 180 top
U5  80.95,63.53 90 bottom
U6  47.93,64.8 90 top
U7  46.66,64.17 270 bottom
U10  73.33,14.64 0 top
U13  79.05,21.62 90 bottom
U19  8.25,50.2 0 top
U20  8.1,65.36 180 bottom
U21  17.14,60.68 0 top
U22  16.18,62.58 90 bottom
U34  40.95,12.73 270 top
U37  46.66,22.89 90 top
U38  45.39,22.25 270 bottom
U$1  40.95,50.83 0 bottom
U$2  51.11,62.89 270 top
U$3  28.25,64.17 270 top
U$4  39.68,66.7 0 bottom
U$9  55.55,65.12 180 top
U$14  16.51,55.6 0 top
U$15  14.28,47.34 90 top
U$16  18.41,52.74 180 top
U$17  20.95,46.71 180 top
U$18  20.63,60.04 270 top
U$35  39.68,8.92 0 bottom
U$36  49.84,20.98 270 top
U$37  26.98,22.25 270 top
U$38  38.41,24.79 0 bottom
U$39  54.28,23.21 180 top

### Tracks (layer width: path | path; a pad name or v marks a point on that pad's centre or on a via)
!CS1  (2 unrouted)
!CS2  (2 unrouted)
!RF_RES1  (via drill 0.6 pad 1.27)
  Top 0.5: v53.01,59.4 52.38,58.77 47.93,58.77 46.61,57.44 U2.32
  Bottom 0.5: U$1.RESET 52.09,58.48 v53.01,59.4
!RF_RES2  (1 unrouted)
+3V3_1  (via drill 0.6 pad 1.27)
  Top 0.5: v53.65,47.97 51.11,47.97 48.57,50.51 R5.2 48.45,52.64 U2.26 42,52.64 41.02,53.62 | C11.1 40.22,48.6 U2.18 40.22,52.82 41.02,53.62 | 41.02,56.23 U2.6 41.02,60.11 42.22,61.31 42.22,61.41 C9.1 | 41.02,56.23 41.02,55.59 | 41.02,55.59 41.02,53.62 | 41.02,55.59 40.77,55.84 U2.11 35.62,55.84 33.33,58.13 30.26,58.13 | U2.4 42.62,56.46 41.25,56.46 41.02,56.23 | 30.26,58.13 R11.1 | U6.5 45.39,63.85 44.76,64.48 42.85,64.48 42.22,63.85 42.22,63.11 C10.1 C9.1 | C9.1 41.9,61.63 | 30.26,58.13 30.26,61.21 29.52,61.94 28.47,61.94 U$3.2
  Bottom 0.5: U$1.VCC 53.21,44.26 C17.1 C16.1 53.43,47.76 v53.65,47.97
+3V3_2  (14 unrouted)
+4.1V
  Bottom 0.61: 71.43,20.35 70.79,20.99 70.79,21.62 69.52,22.89 68.25,22.89 66.98,21.62 66.98,19.08 70.16,15.91 R38.2 R37.2
+BAT1  (1 unrouted)
  Top 0.5: U$2.1 R6.1 | U6.1 49.23,62.45 C14.1 50.05,62.9 U$2.1 | R2.2 54.28,61.31 52.7,62.9 U$2.1
+BAT2  (5 unrouted)
  Top 0.5: U$36.1 R92.1 | U37.1 47.96,20.54 C96.1 48.78,20.99 U$36.1 | 53.01,19.4 51.43,20.99 U$36.1
ANT2
  Bottom 0.5: ANT2.1 30.16,4.16 U$35.ANT
BUZZER  (2 unrouted)
ENA1  (1 unrouted)
  Top 0.5: U6.3 51.01,65.75 R6.2 53.02,65.65 U$9.2
ENA2  (3 unrouted)
  Bottom 0.61: U13.3 75.97,22.57 R31.2 75.45,22.89
GND  (via drill 0.6 pad 1.27)  (2 unrouted)
  Bottom 0.25: 5.37,65.11 C56.1 | U20.3 6.02,65.61 6.02,65.11 | 6.02,65.11 U20.2 7.92,65.11 7.85,65.03 U20.12 7.85,63.13 7.29,62.58 | 6.02,65.11 5.39,65.11 5.39,65.12
  other vias: 79.05,19.71
  pour Top (isolate 0.406): -0.32,70.49 24.21,70.49 24.21,41.58 -0.32,41.58
  pour Bottom (isolate 0.406): 0,41.63 24.44,41.31 24.44,70.52 0,70.2
GND1  (via drill 0.6 pad 1.27)  (17 unrouted)
  Top 0.5: U2.21 42.62,48.84 42.85,48.61 | Q2.2 31.96,65.12 R7.1 | U2.5 41.82,59.64 42.85,60.67 43.49,60.67 | 43.49,60.67 43.49,61.41 C9.2 | U2.3 43.42,60.6 43.49,60.67 | 60,47.02 57.46,47.02 | 60.63,59.72 v55.55,59.72 | 60,64.8 57.46,64.8 | 59.36,52.74 55.55,52.74 | 58.73,5.11 56.19,5.11 | 59.36,17.81 v54.28,17.81 | 58.73,22.89 56.19,22.89 | 58.09,10.83 54.28,10.83
  Bottom 0.5: 60,47.02 57.46,47.02 | 60.63,59.72 v55.55,59.72 | 60,64.8 57.46,64.8 | 59.36,52.74 55.55,52.74 | 59.36,56.55 56.82,56.55 | 58.73,5.11 56.19,5.11 | 59.36,17.81 v54.28,17.81 | 58.73,22.89 56.19,22.89 | 58.09,10.83 54.28,10.83 | 58.09,14.64 55.55,14.64
  other vias: 28.88,47.97 28.88,44.16 47.93,60.35 54.92,54 79.05,66.7 67.62,66.7 67.62,46.38 79.05,46.38 51.11,67.34 27.61,6.06 27.61,2.25 46.66,18.45 53.65,12.09 77.78,24.79 66.35,24.79 66.35,4.47 77.78,4.47
  pour Bottom (isolate 0.406): 87.94,40.67 87.94,71.15 24.44,71.15 24.44,40.67
  pour Top (isolate 0.406): 87.94,40.67 87.94,71.15 24.44,71.15 24.44,40.67
GND2  (7 unrouted)
  pour Top (isolate 0.406): 86.67,-1.24 86.67,29.24 23.17,29.24 23.17,-1.24
  pour Bottom (isolate 0.406): 86.67,-1.24 86.67,29.24 23.17,29.24 23.17,-1.24
MISO1  (via drill 0.6 pad 1.27)
  Top 0.5: U2.16 37.93,51.62 MISO.1 33.65,50.83 32.06,52.42 v28.88,52.42
  Bottom 0.5: U$1.MISO 29.04,52.26 v28.88,52.42
MISO2  (2 unrouted)
MOSI1  (via drill 0.6 pad 1.27)
  Top 0.5: U2.15 35.33,52.64 MOSI.1 33.65,54.32 v28.88,54.32
  Bottom 0.5: U$1.MOSI 28.95,54.26 v28.88,54.32
MOSI2  (2 unrouted)
N$2  (via drill 0.6 pad 1.27)
  Top 0.5: v60.63,63.21 R1.1
  Bottom 0.5: U5.3 77.88,64.48 R9.2 61.8,64.38 v60.63,63.21
N$3  (via drill 0.6 pad 1.27)
  Top 0.5: R2.1 v60.63,61.31
  Bottom 0.5: C18.1 C19.1 76.93,61.83 R9.1 | U5.1 77.88,62.58 R9.1 | v60.63,61.31 62.54,63.21 75.87,63.21 76.51,62.58 77.68,62.58 R9.1
N$6  (via drill 0.6 pad 1.27)
  Top 0.61: U3.7 v84.13,61.63
  Bottom 0.61: v84.13,61.63 R3.1
N$7
  Top 0.61: LED1.A R4.2
N$8
  Top 0.61: U3.13 64.02,56.55 R4.1
N$9  (via drill 0.6 pad 1.27)
  Top 0.61: U3.4 v84.13,52.74 | v63.81,52.74 U3.16
  Bottom 0.61: v84.13,52.74 v63.81,52.74
N$11
  Bottom 0.5: U7.5 43.59,65.12 R12.1
N$12
  Top 0.5: U2.20 41.82,48.74 C7.1
N$13
  Top 0.5: U2.29 47.75,55.04 R5.1 C8.1 50.89,54.22 !RES.1
N$14
  Bottom 0.5: ANT.1 31.43,46.07 U$1.ANT
N$15
  Top 0.5: U2.8 36.66,58.93 34.84,60.75 Q1.2 34.84,64.62 C12.1
N$16
  Top 0.5: U2.7 40.22,61.48 Q1.1 39.89,62.72 C13.1
N$18
  Bottom 0.5: U7.1 47.96,66.16 LED3.C
N$19
  Top 0.5: Q2.1 31.96,63.22 R7.2 R8.1
N$20
  Top 0.5: U2.10 36.41,56.64 33.96,59.09 32.69,59.09 32.06,59.72 R8.2
N$21
  Top 0.5: U$3.1 Q2.3
N$22
  Bottom 0.5: LED3.A R13.2
N$24  (via drill 0.6 pad 1.27)
  Top 0.5: U$4.1 v42.22,66.71
  Bottom 0.5: U7.4 45.18,63.03 C15.1 42.85,61.63 42.22,62.26 v42.22,66.71 R13.1
N$27  (via drill 0.6 pad 1.27)
  Top 0.61: U3.3 83.49,51.47 v84.13,50.83
  Bottom 0.61: U5.5 82.25,60.81 C6.1 C4.1 C5.1 83.49,57.82 83.91,58.24 R3.2 84.98,58.24 85.4,57.82 85.4,51.47 84.76,50.83 v84.13,50.83
N$29  (via drill 0.6 pad 1.27)
  Top 0.61: U10.1 v80.95,12.1 | U10.6 v64.44,17.18
  Bottom 0.61: v64.44,17.18 64.44,13.37 63.81,12.73 63.81,7.02 65.08,5.75 68.25,5.75 68.89,5.11 70.79,5.11 72.06,6.38 77.78,6.38 80.95,9.56 v80.95,12.1
N$30  (via drill 0.6 pad 1.27)
  Top 0.61: U10.7 v65.71,15.91
  Bottom 0.61: v65.71,15.91 67.2,15.91 R22.1
N$31
  Top 0.61: U10.2 82.44,13.37 R23.1
N$32
  Top 0.61: R23.2 82.86,10.08 LED4.A
N$54  (via drill 0.6 pad 1.27)
  Top 0.61: U10.3 83.49,14.64 v84.13,14
  Bottom 0.61: v84.13,14 81.59,14 80.95,13.37 80.32,13.37 79.68,12.73 79.68,12.52 R36.2 79.26,11.29 Q7.2
N$55
  Bottom 0.61: TXO4.1 75.87,8.29 | 75.87,8.29 77.61,8.29 Q7.3 | R37.1 75.87,8.29
N$56
  Bottom 0.61: Q8.3 69.68,8.92 R38.1 RXIH.1
N$57  (via drill 0.6 pad 1.27)
  Top 0.61: U10.10 v65.71,12.1
  Bottom 0.61: v65.71,12.1 R35.1 65.81,9.87 Q8.2
N$132  (3 unrouted)
N$133  (3 unrouted)
N$134  (1 unrouted)
N$135  (1 unrouted)
N$136  (1 unrouted)
N$137  (1 unrouted)
N$138  (1 unrouted)
N$139  (1 unrouted)
N$140  (1 unrouted)
N$141  (1 unrouted)
N$142  (3 unrouted)
  Top 0.5: U$18.1 20.63,63.85 19.99,64.48 18.72,64.48
N$162
  Top 0.5: U34.20 40.55,6.83 C89.1
N$163
  Top 0.5: U34.29 46.48,13.13 R88.1 C90.1 49.62,12.31 !RES3.1
N$165
  Top 0.5: U34.8 35.39,17.02 33.57,18.84 Q13.2 33.57,22.71 C94.1
N$166
  Top 0.5: U34.7 38.95,19.57 Q13.1 38.62,20.81 C95.1
N$167
  Top 0.5: Q14.1 30.69,21.31 R89.2 R90.1
N$168
  Top 0.5: U34.10 35.14,14.73 32.69,17.18 31.42,17.18 30.79,17.81 R90.2
N$169
  Top 0.5: U$37.1 Q14.3
N$171
  Bottom 0.5: U38.5 42.32,23.21 R94.1
N$172
  Bottom 0.5: U38.1 46.69,24.25 LED21.C
N$173
  Bottom 0.5: LED21.A R95.2
N$174  (via drill 0.6 pad 1.27)
  Top 0.5: U$38.1 v40.95,24.8
  Bottom 0.5: U38.4 43.91,21.12 C101.1 41.58,19.72 40.95,20.35 v40.95,24.8 R95.1
PYRO  (2 unrouted)
RF_RTTY1  (1 unrouted)
RF_RTTY2  (1 unrouted)
RXI1  (2 unrouted)
RXI2
  Top 0.5: U34.30 51.36,13.93 52.06,14.63 RXI_5.1 53.97,14.32 54.28,14.32 56.19,12.41
RXI_G1  (via drill 0.6 pad 1.27)
  Top 0.5: R10.1 v60.63,58.13 | U3.19 64.13,48.93 v63.81,49.24
  Bottom 0.5: v60.63,58.13 60.63,51.15 62.54,49.24 v63.81,49.24 64.44,48.61 RXI1.1
SCK1  (1 unrouted)
  Top 0.5: U2.17 39.42,50.25 38.41,49.24 37.46,49.24 SCK.1
SCK2  (2 unrouted)
SCL  (3 unrouted)
SDA  (3 unrouted)
TXO1  (2 unrouted)
TXO2
  Top 0.5: U34.31 48.03,14.73 TXO_3.1 48.89,15.59 51.11,15.59 51.74,16.22
TXO_G1  (via drill 0.6 pad 1.27)
  Top 0.5: U3.18 64.76,50.2 v63.81,51.15 | R14.1 v61.9,54.32
  Bottom 0.5: v61.9,54.32 61.9,51.78 62.54,51.15 v63.81,51.15 64.76,50.2 TXO1.1
UART  (1 unrouted)
V+  (via drill 0.6 pad 1.27)
  Top 0.61: U10.4 v82.86,15.91
  Bottom 0.61: v82.86,15.91 C22.1 | C22.1 C24.1 C23.1 81.17,19.85 U13.5 | C22.1 81.17,15.49 80.32,14.64 79.68,14.64 77.56,12.52 R36.1 77.46,12 Q7.1 77.1,10.83 67.62,10.83 | R35.2 65.81,7.97 Q8.1 67.3,7.97 67.62,8.29 67.62,10.83 | 67.62,10.83 R22.2
VBAT  (5 unrouted)
VCC  (13 unrouted)